# Altium schematic sheet sch_substrate_board_zynq.SchDoc
size A4; SheetNumber: 3; SheetTotal: 6
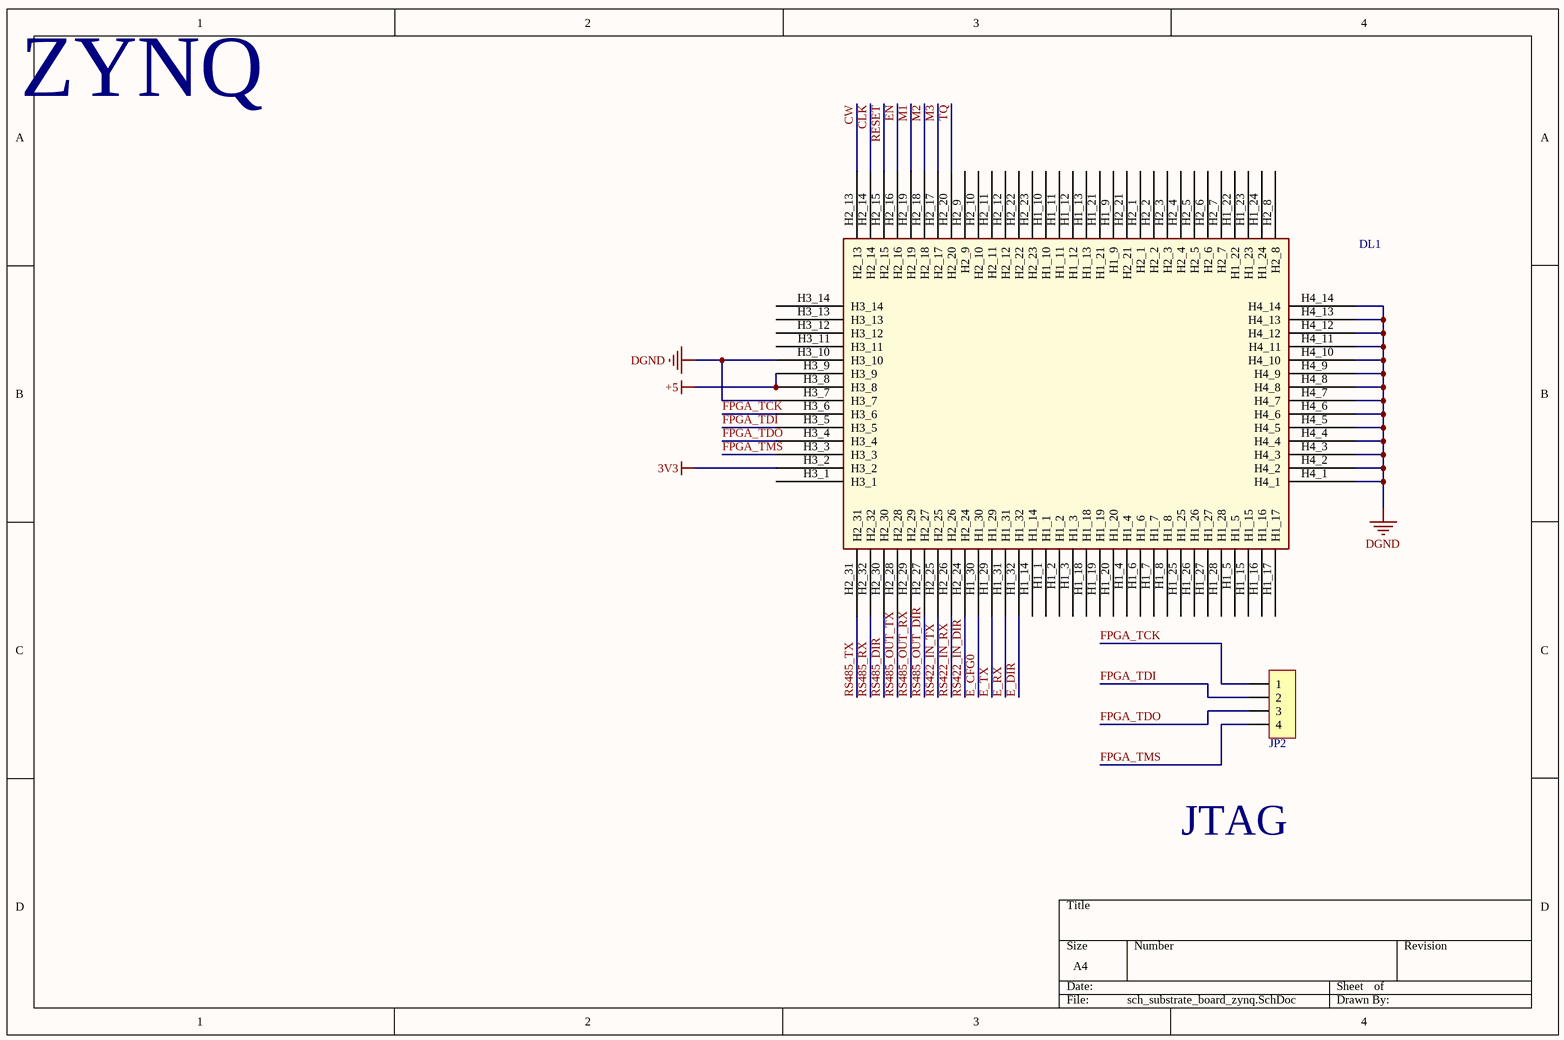
[diagram p0: sch_substrate_board_zynq.SchDoc]

## Parts
DL1  SSH  [SSH]  (value not drawn)
JP2  HDR-1X4  [XH2.54-LI-4P]  (value not drawn)

## Nets
3V3: DL1.H3_2
+5: DL1.H3_8 DL1.H3_9
DGND: DL1.H3_7 DL1.H3_10 DL1.H4_1 DL1.H4_2 DL1.H4_3 DL1.H4_4 DL1.H4_5 DL1.H4_6 DL1.H4_7 DL1.H4_8 DL1.H4_9 DL1.H4_10 DL1.H4_11 DL1.H4_12 DL1.H4_13 DL1.H4_14
CLK: DL1.H2_14
CW: DL1.H2_13
E_CFG0: DL1.H1_30
E_DIR: DL1.H1_32
E_RX: DL1.H1_31
E_TX: DL1.H1_29
EN: DL1.H2_16
FPGA_TCK: DL1.H3_6 JP2.1
FPGA_TDI: DL1.H3_5 JP2.2
FPGA_TDO: DL1.H3_4 JP2.3
FPGA_TMS: DL1.H3_3 JP2.4
M1: DL1.H2_19
M2: DL1.H2_18
M3: DL1.H2_17
RESET: DL1.H2_15
RS422_IN_DIR: DL1.H2_24
RS422_IN_RX: DL1.H2_26
RS422_IN_TX: DL1.H2_25
RS485_DIR: DL1.H2_30
RS485_OUT_DIR: DL1.H2_27
RS485_OUT_RX: DL1.H2_29
RS485_OUT_TX: DL1.H2_28
RS485_RX: DL1.H2_32
RS485_TX: DL1.H2_31
TQ: DL1.H2_20

Not connected (* = marked no-connect by the designer): DL1 H1_1 H1_2 H1_3 H1_4 H1_5 H1_6 H1_7 H1_8 H1_9 H1_10 H1_11 H1_12 H1_13 H1_14 H1_15 H1_16 H1_17 H1_18 H1_19 H1_20 H1_21 H1_22 H1_23 H1_24 H1_25 H1_26 H1_27 H1_28 H2_1 H2_2 H2_3 H2_4 H2_5 H2_6 H2_7 H2_8 H2_9 H2_10 H2_11 H2_12 H2_21 H2_22 H2_23 H3_1 H3_11 H3_12 H3_13 H3_14

## Notes on the sheet
- ZYNQ
- JTAG

## Library data of the parts
JP2 = Header 4: 4P接插件; 版权归属: 封装库来自淘宝 ID：黄晶宝石; BOM名称: 4P接插件; 学习资源: https://shop463601444.taobao.com